# EAGLE design serial led controller (EAGLE 6.4)

## Sheet 1 of 2
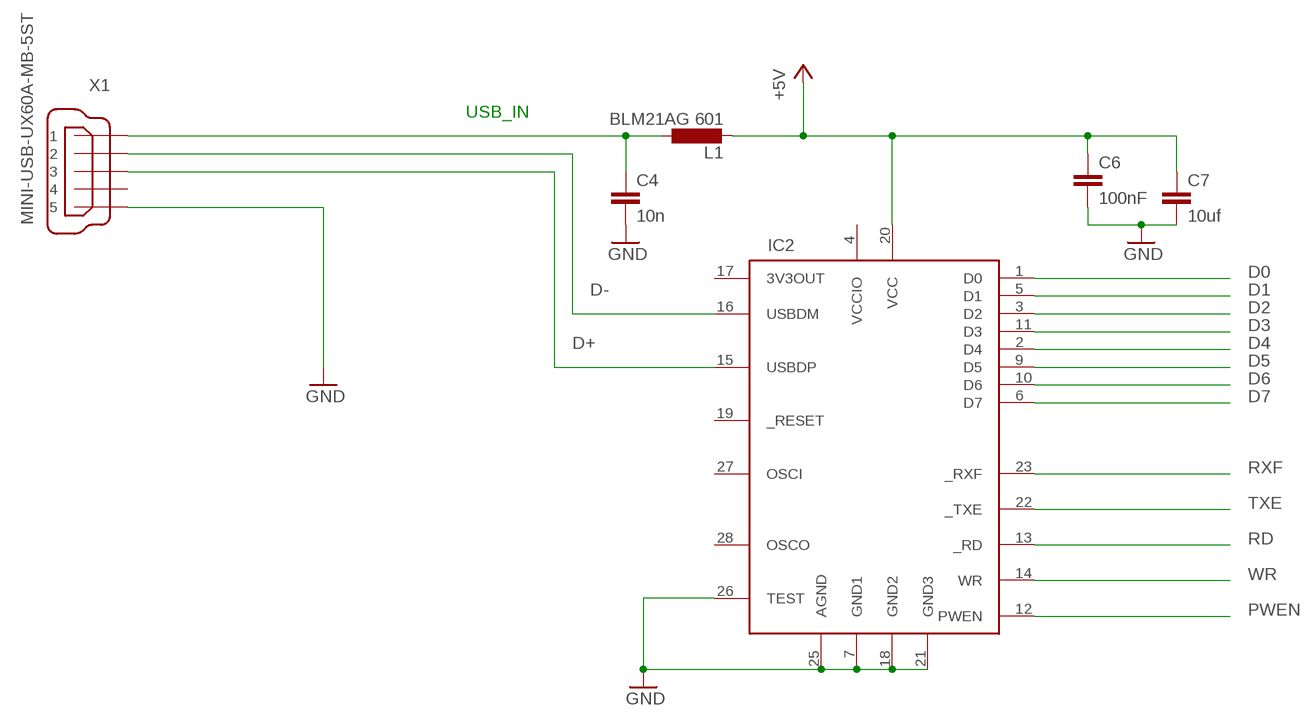
[diagram p0: schematic, sheet 1]

### Parts
C4  10n  C-EUC0603K  [C0603K]
C6  100nF  C-EUC0603K  [C0603K]
C7  10uf  C-EUC0603K  [C0603K]
IC2  FT245RL  [SSOP28DB]
L1  BLM21AG 601  L-EUL805  [L805]
X1  MINI-USB-UX60A-MB-5ST  [UX60A-MB-5ST]

### Nets
+5V: C6.1 C7.1 IC2.20(VCC) L1.2 ; also sheet 2
D0: IC2.1(D0) ; also sheet 2
D1: IC2.5(D1) ; also sheet 2
D2: IC2.3(D2) ; also sheet 2
D3: IC2.11(D3) ; also sheet 2
D4: IC2.2(D4) ; also sheet 2
D5: IC2.9(D5) ; also sheet 2
D6: IC2.10(D6) ; also sheet 2
D7: IC2.6(D7) ; also sheet 2
D+: IC2.15(USBDP) X1.3
D-: IC2.16(USBDM) X1.2
GND: C4.2 C6.2 C7.2 IC2.7(GND1) IC2.18(GND2) IC2.21(GND3) IC2.25(AGND) IC2.26(TEST) X1.5 ; also sheet 2
PWEN: IC2.12(PWEN)
RD: IC2.13(_RD) ; also sheet 2
RXF: IC2.23(_RXF) ; also sheet 2
TXE: IC2.22(_TXE) ; also sheet 2
USBSUPPLY: C4.1 L1.1 X1.1
WR: IC2.14(WR) ; also sheet 2
Unconnected: IC2.17(3V3OUT) IC2.19(_RESET) IC2.27(OSCI) IC2.28(OSCO) X1.4

### Notes on the sheet
- USB_IN

## Sheet 2 of 2
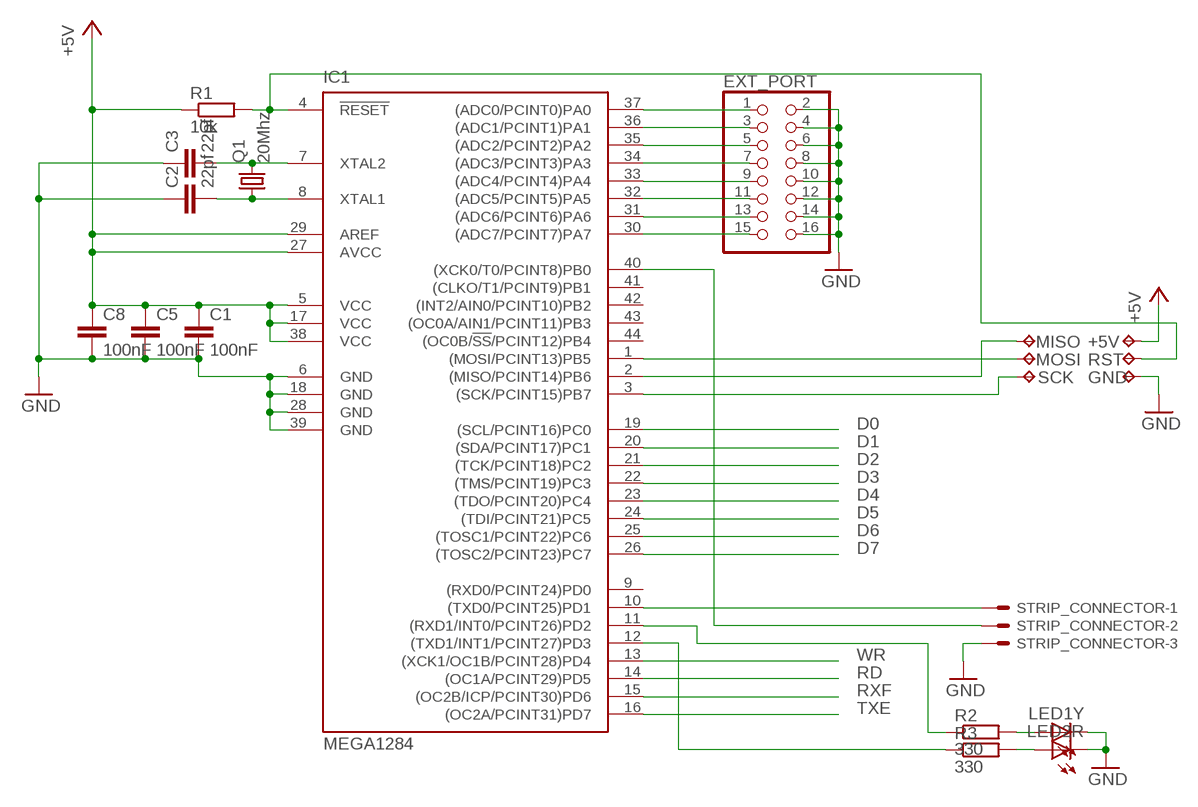
[diagram p1: schematic, sheet 2]

### Parts
+5V  TPTP19R  [TP19R]
C1  100nF  C-EUC0603K  [C0603K]
C2  22pf  C-EUC0603K  [C0603K]
C3  22pf  C-EUC0603K  [C0603K]
C5  100nF  C-EUC0603K  [C0603K]
C8  100nF  C-EUC0603K  [C0603K]
EXT_PORT  PINHD-2X8  [2X08]
GND  TPTP19R  [TP19R]
IC1  MEGA1284  MEGA164P/324P/644P-AU  [TQFP44]
LED1Y  LEDCHIP-LED0603  [CHIP-LED0603]
LED2R  LEDCHIP-LED0603  [CHIP-LED0603]
MISO  TPTP19R  [TP19R]
MOSI  TPTP19R  [TP19R]
Q1  20Mhz  CRYSTALSM49  [SM49]
R1  10k  R-EU_603  [R0603]
R2  330  R-EU_603  [R0603]
R3  330  R-EU_603  [R0603]
RST  TPTP19R  [TP19R]
SCK  TPTP19R  [TP19R]
STRIP_CONNECTOR  22-27-2031-03  [6410-03]

### Nets
+5V: +5V.TP C1.1 C5.1 C8.1 IC1.5(VCC) IC1.17(VCC) IC1.27(AVCC) IC1.29(AREF) IC1.38(VCC) R1.1 ; also sheet 1
CLOCK: IC1.40((XCK0/T0/PCINT8)PB0) STRIP_CONNECTOR.2
D0: IC1.19((SCL/PCINT16)PC0) ; also sheet 1
D1: IC1.20((SDA/PCINT17)PC1) ; also sheet 1
D2: IC1.21((TCK/PCINT18)PC2) ; also sheet 1
D3: IC1.22((TMS/PCINT19)PC3) ; also sheet 1
D4: IC1.23((TDO/PCINT20)PC4) ; also sheet 1
D5: IC1.24((TDI/PCINT21)PC5) ; also sheet 1
D6: IC1.25((TOSC1/PCINT22)PC6) ; also sheet 1
D7: IC1.26((TOSC2/PCINT23)PC7) ; also sheet 1
DATA: IC1.10((TXD0/PCINT25)PD1) STRIP_CONNECTOR.1
GND: C1.2 C2.1 C3.1 C5.2 C8.2 EXT_PORT.2 EXT_PORT.4 EXT_PORT.6 EXT_PORT.8 EXT_PORT.10 EXT_PORT.12 EXT_PORT.14 EXT_PORT.16 GND.TP IC1.6(GND) IC1.18(GND) IC1.28(GND) IC1.39(GND) LED1Y.C LED2R.C STRIP_CONNECTOR.3 ; also sheet 1
MISO: IC1.2((MISO/PCINT14)PB6) MISO.TP
MOSI: IC1.1((MOSI/PCINT13)PB5) MOSI.TP
N$1: EXT_PORT.15 IC1.30((ADC7/PCINT7)PA7)
N$2: EXT_PORT.13 IC1.31((ADC6/PCINT6)PA6)
N$3: IC1.11((RXD1/INT0/PCINT26)PD2) R2.1
N$4: EXT_PORT.11 IC1.32((ADC5/PCINT5)PA5)
N$5: EXT_PORT.9 IC1.33((ADC4/PCINT4)PA4)
N$6: IC1.12((TXD1/INT1/PCINT27)PD3) R3.1
N$7: EXT_PORT.7 IC1.34((ADC3/PCINT3)PA3)
N$8: C2.2 IC1.8(XTAL1) Q1.1
N$9: C3.2 IC1.7(XTAL2) Q1.2
N$10: EXT_PORT.5 IC1.35((ADC2/PCINT2)PA2)
N$11: EXT_PORT.3 IC1.36((ADC1/PCINT1)PA1)
N$13: EXT_PORT.1 IC1.37((ADC0/PCINT0)PA0)
N$21: LED1Y.A R2.2
N$22: LED2R.A R3.2
RD: IC1.14((OC1A/PCINT29)PD5) ; also sheet 1
RST: IC1.4(!RESET) R1.2 RST.TP
RXF: IC1.15((OC2B/ICP/PCINT30)PD6) ; also sheet 1
SCK: IC1.3((SCK/PCINT15)PB7) SCK.TP
TXE: IC1.16((OC2A/PCINT31)PD7) ; also sheet 1
WR: IC1.13((XCK1/OC1B/PCINT28)PD4) ; also sheet 1
Unconnected: IC1.9((RXD0/PCINT24)PD0) IC1.41((CLKO/T1/PCINT9)PB1) IC1.42((INT2/AIN0/PCINT10)PB2) IC1.43((OC0A/AIN1/PCINT11)PB3) IC1.44((OC0B/!SS!/PCINT12)PB4)

## Power pins joined to a net without a drawn wire
VCCIO: IC2.4(VCCIO)

## Library data of the parts
+5V GND MISO MOSI RST SCK = testpad:TP: Test pad
C1-C8 = rcl:C-EU: CAPACITOR, European symbol
EXT_PORT = pinhead:PINHD-2X8: PIN HEADER
IC1 = 0_avr:MEGA164P/324P/644P-AU
IC2 = ftdichip-3:FT245RL: USB FIFO Controller 4th Generation USB Controller (USB <-> Parallel) - FIFO
L1 = 0_Standard-Parts:L-EU: INDUCTOR, European symbol
LED1Y LED2R = led:LED: LED OSRAM: - CHIPLED LG R971, LG N971, LY N971, LG Q971, LY Q971, LO R971, LY R971 LH N974, LH R974 LS Q976, LO Q976, LY Q976 LO Q996 - Hyper CHIPLED LW Q18S LB Q993, LB Q99A, LB R99A - SideLED LS A670, LO A670, LY A670, LG A670, LP A670 LB A673, LV A673, LT A673, LW A673 LH A674 LY A675 LS A676, LA A676, LO A676, LY A676, LW A676 LS A679, LY A679, LG A679 - Hyper Micro SIDELED® LS Y876, LA Y876, LO Y876, LY Y876 LT Y87S - SmartLED LW L88C, LW L88S LB L89C, LB L89S, LG L890 LS L89K, LO L89K, LY L89K LS L896, LA L896, LO L896, LY L896 - TOPLED LS T670, LO T670, LY T670, LG T670, LP T670 LSG T670, LSP T670, LSY T670, LOP T670, LYG T670 LG T671, LOG T671, LSG T671 LB T673, LV T673, LT T673, LW T673 LH T674 LS T676, LA T676, LO T676, LY T676, LB T676, LH T676, LSB T676, LW T676 LB T67C, LV T67C, LT T67C, LS T67K, LO T67K, LY T67K, LW E67C LS E67B, LA E67B, LO E67B, LY E67B, LB E67C, LV E67C, LT E67C LW T67C LS T679, LY T679, LG T679 LS T770, LO T770, LY T770, LG T770, LP T770 LB T773, LV T773, LT T773, LW T773 LH T774 LS E675, LA E675, LY E675, LS T675 LS T776, LA T776, LO T776, LY T776, LB T776 LHGB T686 LT T68C, LB T68C - Hyper Mini TOPLED® LB M676 - Mini TOPLED Santana® LG M470 LS M47K, LO M47K, LY M47K Source: http://www.osram.convergy.de LUXEON: - LUMILED® LXK2-PW12-R00, LXK2-PW12-S00, LXK2-PW14-U00, LXK2-PW14-V00 LXK2-PM12-R00, LXK2-PM12-S00, LXK2-PM14-U00 LXK2-PE12-Q00, LXK2-PE12-R00, LXK2-PE12-S00, LXK2-PE14-T00, LXK2-PE14-U00 LXK2-PB12-K00, LXK2-PB12-L00, LXK2-PB12-M00, LXK2-PB14-N00, LXK2-PB14-P00, LXK2-PB14-Q00 LXK2-PR12-L00, LXK2-PR12-M00, LXK2-PR14-Q00, LXK2-PR14-R00 LXK2-PD12-Q00, LXK2-PD12-R00, LXK2-PD12-S00 LXK2-PH12-R00, LXK2-PH12-S00 LXK2-PL12-P00, LXK2-PL12-Q00, LXK2-PL12-R00 Source: www.luxeon.com KINGBRIGHT: KA-3528ASYC Source: www.kingbright.com
Q1 = crystal:CRYSTAL: CRYSTAL; OC_FARNELL: unknown; OC_NEWARK: unknown
R1-R3 = 0_Standard-Parts:R-EU_: RESISTOR, European symbol
STRIP_CONNECTOR = con-molex:22-?-03: CONNECTOR wire to board 2.54 mm (.1 inch) pitch header; OC_FARNELL: unknown; OC_NEWARK: unknown
X1 = con-hirose:MINI-USB-: MINI USB Connector Source: http://www.hirose.co.jp/cataloge_hp/e24000019.pdf; OC_FARNELL: unknown; OC_NEWARK: unknown

## Board
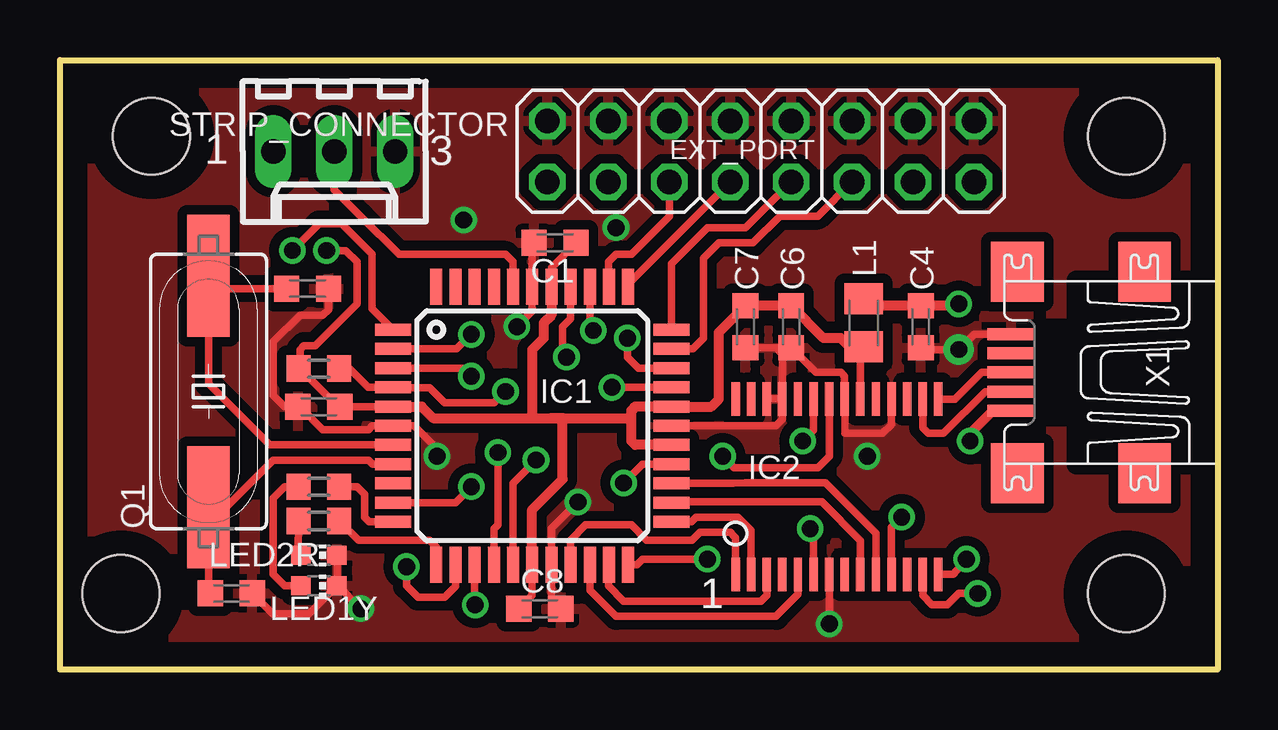
[diagram p2: board, top side]
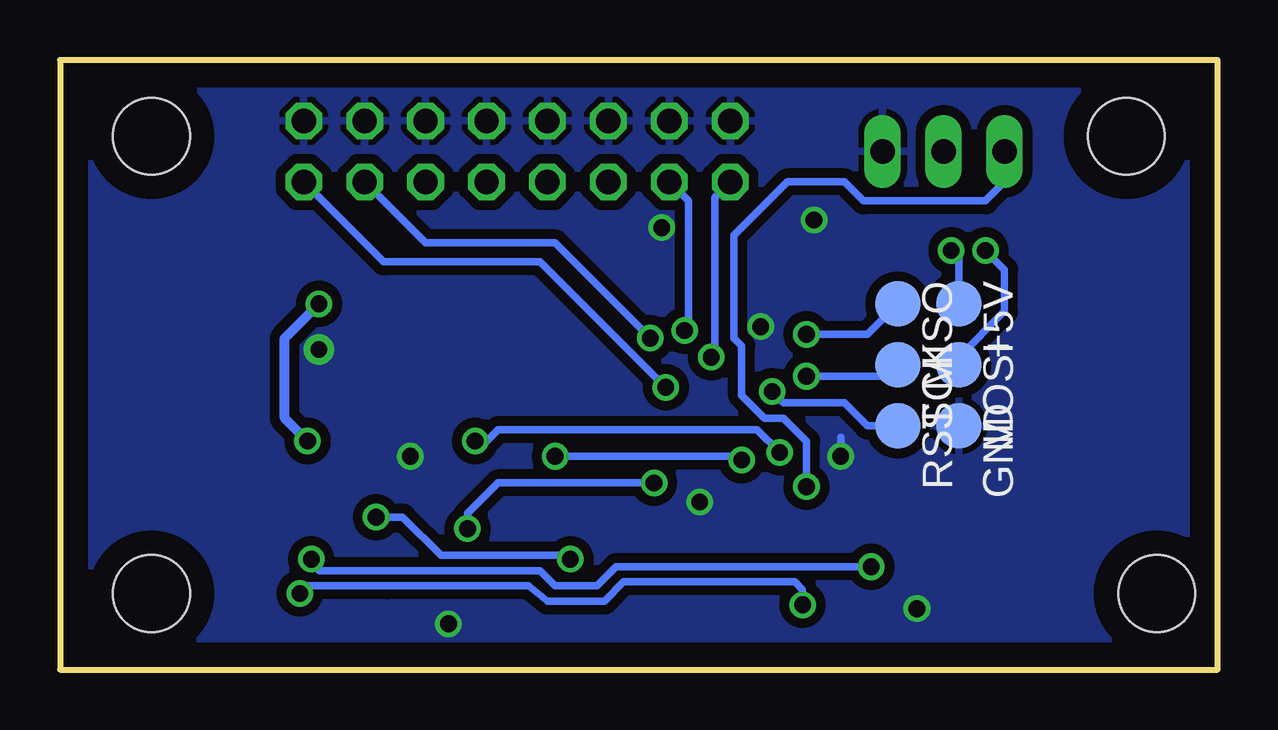
[diagram p3: board, bottom side, seen from below]

Size 48.26 x 25.4 mm. Coordinates in mm from the lower left corner, seen from the top.
Outline: 0,0 0,25.4 48.26,25.4 48.26,0 0,0
Copper layers (1*16): Top 0.035mm / dielectric 1.5mm / Bottom 0.035mm
Design rules "Bilex DRU *": minimum track width 10mil, minimum drill 24mil, track to track 10mil, track to pad 10mil, pad to pad 10mil, via to via 10mil, smd to smd 10mil, copper to edge 40mil, drill to drill 8mil, minimum pad ring 10mil, minimum via ring 8mil, stop-mask expansion 4mil, vias tented up to drill 0mil, thermal gap 10mil
Holes 3.2 mm at 44.45,22.23 44.45,3.17 2.54,3.17 3.81,22.23

### Footprints (pad centres in the part's own frame; a part is rotated, then mirrored left to right if it is on the bottom)
TP19R = smd 1.9 x 1.9: TP 0,0
C0603K = smd 1.05 x 1.08: 1 -0.875,0; 2 0.875,0
2X08 = drill 1.016 octagon: 1 -8.89,-1.27; 2 -8.89,1.27; 3 -6.35,-1.27; 4 -6.35,1.27; 5 -3.81,-1.27; 6 -3.81,1.27; 7 -1.27,-1.27; 8 -1.27,1.27; 9 1.27,-1.27; 10 1.27,1.27; 11 3.81,-1.27; 12 3.81,1.27; 13 6.35,-1.27; 14 6.35,1.27; 15 8.89,-1.27; 16 8.89,1.27
TQFP44 = smd 1.5 x 0.5: 1 -5.8,4; 2 -5.8,3.2; 3 -5.8,2.4; 4 -5.8,1.6; 5 -5.8,0.8; 6 -5.8,0; 7 -5.8,-0.8; 8 -5.8,-1.6; 9 -5.8,-2.4; 10 -5.8,-3.2; 11 -5.8,-4; 23 5.8,-4; 24 5.8,-3.2; 25 5.8,-2.4; 26 5.8,-1.6; 27 5.8,-0.8; 28 5.8,0; 29 5.8,0.8; 30 5.8,1.6; 31 5.8,2.4; 32 5.8,3.2; 33 5.8,4 | smd 0.5 x 1.5: 12 -4,-5.8; 13 -3.2,-5.8; 14 -2.4,-5.8; 15 -1.6,-5.8; 16 -0.8,-5.8; 17 0,-5.8; 18 0.8,-5.8; 19 1.6,-5.8; 20 2.4,-5.8; 21 3.2,-5.8; 22 4,-5.8; 34 4,5.8; 35 3.2,5.8; 36 2.4,5.8; 37 1.6,5.8; 38 0.8,5.8; 39 0,5.8; 40 -0.8,5.8; 41 -1.6,5.8; 42 -2.4,5.8; 43 -3.2,5.8; 44 -4,5.8
SSOP28DB = smd 0.348 x 1.397: 1 -4.225,-3.656; 2 -3.575,-3.656; 3 -2.925,-3.656; 4 -2.275,-3.656; 5 -1.625,-3.656; 6 -0.975,-3.656; 7 -0.325,-3.656; 8 0.325,-3.656; 9 0.975,-3.656; 10 1.625,-3.656; 11 2.275,-3.656; 12 2.925,-3.656; 13 3.575,-3.656; 14 4.225,-3.656; 15 4.225,3.656; 16 3.575,3.656; 17 2.925,3.656; 18 2.275,3.656; 19 1.625,3.656; 20 0.975,3.656; 21 0.325,3.656; 22 -0.325,3.656; 23 -0.975,3.656; 24 -1.625,3.656; 25 -2.275,3.656; 26 -2.925,3.656; 27 -3.575,3.656; 28 -4.225,3.656
L805 = smd 1.3 x 1.6: 1 -1,0; 2 1,0
CHIP-LED0603 = smd 0.8 x 0.8: A 0,-0.75; C 0,0.75
SM49 = smd 5.08 x 1.778: 1 -4.826,0; 2 4.826,0
R0603 = smd 1 x 1.1: 1 -0.85,0; 2 0.85,0
6410-03 = drill 1.016 long: 1 2.54,0; 2 0,0; 3 -2.54,0
UX60A-MB-5ST = smd 2 x 0.5: 1 2.25,1.6; 2 2.25,0.8; 3 2.25,0; 4 2.25,-0.8; 5 2.25,-1.6 | smd 2.2 x 2.5: M1 -3.3,-4.2; M2 -3.3,4.2; M3 2,4.2; M4 2,-4.2

### Placement (x,y rotation side)
+5V  10.79,15.24 270 bottom
C1  20.64,17.78 180 top
C2  7.14,3.17 180 top
C3  10.32,15.88 180 top
C4  35.88,14.29 270 top
C5  10.79,10.95 180 top
C6  30.48,14.29 270 top
C7  28.57,14.29 270 top
C8  20,2.54 0 top
EXT_PORT  29.21,21.59 0 top
GND  10.79,10.16 270 bottom
IC1  19.68,10.16 0 top
IC2  32.38,7.62 0 top
L1  33.5,14.45 270 top
LED1Y  10.79,3.49 270 top
LED2R  10.79,4.76 270 top
MISO  13.34,15.24 270 bottom
MOSI  10.79,12.7 270 bottom
Q1  6.19,11.59 90 top
R1  10.79,12.54 0 top
R2  10.79,7.62 180 top
R3  10.79,6.19 180 top
RST  13.34,10.16 270 bottom
SCK  13.34,12.7 270 bottom
STRIP_CONNECTOR  11.43,21.59 180 top
X1  41.91,12.38 180 top

### Tracks (layer width: path | path; a pad name or v marks a point on that pad's centre or on a via)
+5V  (via drill 0.7)
  Top 0.305: IC2.20 33.36,13.27 | 33.36,13.27 L1.2 | 33.36,13.27 33.09,13.27 | IC1.17 19.68,3.1 C8.1 | 21.59,17.78 C1.1 20.48,16.75 IC1.38 | IC1.5 C5.1 11.59,10.95 11.11,11.43 10,12.54 R1.1 10,12.6 10,13.18 10,13.34 10.16,13.49 10.64,13.49 12.38,15.24 12.38,16.99 11.91,17.46 v11.11,17.46
  Top 0.406: IC1.27 23.98,9.36 23.81,9.53 23.81,10.48 | 23.81,10.48 23.81,10.79 23.98,10.96 IC1.29 27.15,10.96 27.46,11.27 27.46,14.05 C7.1 C6.1 31.83,13.81 32.54,13.81 33.09,13.27 | 20.95,10.48 20.48,10.48 | 20.48,10.48 20.95,10.48 | 20.95,10.48 23.81,10.48 | IC1.17 19.68,6.67 20.95,7.94 20.95,10.48 | IC1.5 15.09,10.96 14.92,10.95 15.08,10.95 15.56,10.48 19.68,10.48 | IC1.38 20.48,14.92 20.48,14.77 20.16,14.45 20.16,13.81 19.68,13.34 19.68,11.59 19.68,10.48 | 19.68,10.48 20.48,10.48
  Bottom 0.305: 10.79,15.72 +5V.TP 10.79,17.14 v11.11,17.46
CLOCK
  Top 0.305: STRIP_CONNECTOR.2 11.43,20 12.54,18.89 14.13,17.3 15.24,17.3 18.57,17.3 18.89,16.99 IC1.40
D0
  Top 0.305: IC1.19 21.27,4.37 21.27,5.4 21.91,6.03 23.81,6.03 24.45,5.4 26.35,5.4 26.67,5.71 27.94,5.71 28.1,5.56 28.16,5.5 IC2.1
D1
  Top 0.305: IC2.5 30.76,3.14 29.84,2.22 23.18,2.22 22.23,3.17 22.09,3.31 IC1.20
D2
  Top 0.305: IC2.3 29.46,3.11 29.21,2.86 23.5,2.86 22.86,3.49 22.86,4.33 IC1.21
D3  (via drill 0.7)
  Top 0.305: IC1.22 24.05,4.36 24.29,4.6 v26.99,4.6 | IC2.11 34.66,5.93 v35.08,6.35
  Bottom 0.305: v26.99,4.6 27.15,4.76 32.38,4.76 33.97,6.35 v35.08,6.35
D4
  Top 0.305: IC1.23 26.32,6.16 26.51,6.35 28.26,6.35 28.81,5.8 IC2.2
D5
  Top 0.305: IC2.9 33.36,5.38 31.75,6.99 28.89,6.99 28.26,6.99 25.51,6.99 IC1.24
D6
  Top 0.305: IC1.25 28.08,7.76 28.57,7.78 31.91,7.78 33.81,5.87 34.01,5.68 IC2.10
D7  (via drill 0.7)
  Top 0.305: IC1.26 24.28,8.56 v23.5,7.78 | IC2.6 31.41,5.74 v31.27,5.87
  Bottom 0.305: v23.5,7.78 30,7.78 31.27,6.51 v31.27,5.87
D+
  Top 0.305: X1.3 38.42,12.38 37.31,11.27 IC2.15
D-
  Top 0.305: X1.2 38.57,11.58 36.83,9.84 36.2,9.84 35.96,10.08 IC2.16
DATA  (via drill 0.7)
  Top 0.305: IC1.10 16.48,6.96 v17.14,7.62
  Bottom 0.305: v17.14,7.62 17.14,9.53 18.1,10.48 18.89,10.48 19.84,11.43 19.84,13.49 20.16,13.81 20.16,18.1 19.21,19.05 17.94,20.32 15.56,20.32 14.76,19.53 9.68,19.53 8.89,20.32 8.89,20.95 STRIP_CONNECTOR.1
GND  (via drill 0.7, 0.7 pad 1.27)
  Top 0.305: IC2.26 IC2.25 | IC2.7 32.07,3.97 v32.07,1.91 | IC2.18 34.66,10.21 34.29,9.84 32.72,9.84 32.71,9.85 IC2.21 32.7,11.91 32.7,12.22 32.54,12.38 31.51,12.38 C6.2 | X1.5 38.11,13.98 v37.47,13.34 35.64,13.34 C4.2 | C6.2 29.84,13.41 | 29.84,13.41 C7.2 | IC2.25 30.11,13.15 29.84,13.41 | 30.56,13.34 C6.2 | C8.2 20.48,2.93 IC1.18 20.48,5.88 v21.59,6.99 | IC1.28 29.84,10.16 30.11,10.43 IC2.25 | v19.05,14.29 19.68,14.92 IC1.39 19.68,17.54 C1.2 | 10.28,2.22 10.38,2.32 | 10.38,2.32 LED1Y.C | LED2R.C LED1Y.C | C3.1 11.19,15.16 11.19,15 10.95,14.76 10,14.76 8.89,13.65 8.89,11.43 9.37,10.95 C5.2 10,10.95 10.95,10 12.86,10 13.02,10.16 IC1.6 14.76,10.16 15.08,9.84 15.72,9.21 v15.72,8.89 | LED1Y.C 11.59,3.49 v12.54,2.54 | C2.1 8.87,2.32 10.38,2.32
  Bottom 0.305: v19.05,14.29 19.21,14.13 | v21.59,6.99 21.59,6.67 | v15.72,8.89 15.72,9.68 | v12.54,2.54 12.7,2.38
  other vias: 33.66,8.89 16.83,18.73 23.18,18.41
  pour Bottom (isolate 0.406): 46.99,24.13 46.99,1.27 1.27,1.27 1.27,24.13
  pour Top (isolate 0.406): 1.27,24.13 46.99,24.13 46.99,1.27 1.27,1.27
MISO  (via drill 0.7)
  Top 0.305: IC1.2 16.54,13.36 v17.14,13.97
  Bottom 0.305: v17.14,13.97 14.61,13.97 MISO.TP
MOSI  (via drill 0.7)
  Top 0.305: v9.68,17.46 10.79,18.57 11.75,18.57 13.02,17.3 13.02,15.03 IC1.1
  Bottom 0.305: MOSI.TP 10.79,13.02 8.89,14.92 8.89,16.67 v9.68,17.46
N$1  (via drill 0.7)
  Top 0.305: IC1.30 v23.01,11.76
  Bottom 0.305: v23.01,11.76 23.01,11.73 28.26,16.99 34.77,16.99 EXT_PORT.15
N$2  (via drill 0.7)
  Top 0.305: IC1.31 24.11,12.56 23.65,13.02 v23.65,13.81
  Bottom 0.305: v23.65,13.81 27.62,17.78 33.02,17.78 EXT_PORT.13
N$3
  Top 0.305: IC1.11 12.89,6.16 12.7,6.35 12.7,7.3 12.38,7.62 R2.1
N$4
  Top 0.305: IC1.32 26.38,13.36 26.83,13.81 26.83,17.14 27.46,17.78 28.89,17.78 30,18.89 31.59,18.89 EXT_PORT.11
N$5
  Top 0.305: IC1.33 25.48,16.91 26.99,18.41 28.57,18.41 EXT_PORT.9
N$6
  Top 0.305: IC1.12 15.69,5.11 15.4,5.4 12.44,5.4 R3.1 11.8,6.03
N$7
  Top 0.305: EXT_PORT.7 26.04,18.41 24.13,16.51 23.68,16.07 IC1.34
N$8
  Top 0.305: IC1.8 13.03,8.56 12.86,8.73 8.89,8.73 8.72,8.56 6.67,6.51 6.67,4.7 Q1.1 6.19,3.25 C2.2
N$9
  Top 0.305: IC1.7 8.74,9.36 6.19,11.91 Q1.2 6.19,15.56 6.51,15.88 C3.2
N$10
  Top 0.305: EXT_PORT.5 25.4,18.89 23.81,17.3 23.18,17.3 22.86,16.99 22.86,15.98 IC1.35
N$11  (via drill 0.7)
  Top 0.305: IC1.36 22.09,14.27 v22.23,14.13
  Bottom 0.305: v22.23,14.13 22.07,14.29 22.07,19.21 22.07,19.53 EXT_PORT.3
N$13  (via drill 0.7)
  Top 0.305: IC1.37 21.29,14.62 20.95,14.29 20.95,13.18 v21.11,13.02
  Bottom 0.305: v21.11,13.02 20.95,13.18 20.95,19.68 EXT_PORT.1
N$21
  Top 0.305: R2.2 9.37,7.62 8.89,7.14 8.89,3.97 9.37,3.49 LED1Y.A
N$22
  Top 0.305: R3.2 9.92,4.89 LED2R.A
RD  (via drill 0.7)
  Top 0.305: IC1.14 17.29,2.72 v17.3,2.7 | IC2.13 35.96,3.09 36.35,2.7 36.99,2.7 37.47,3.17 v38.26,3.17
  Bottom 0.305: v17.3,2.7 17.3,3.33 17.62,3.65 24.77,3.65 25.56,2.86 27.94,2.86 28.73,3.49 34.61,3.49 37.94,3.49 v38.26,3.17
RST  (via drill 0.7)
  Top 0.305: 11.79,12.39 R1.2 12.06,12.54 12.22,12.38 12.85,11.76 IC1.4 13.9,11.75 15.4,11.75 16.03,11.11 18.1,11.11 v18.57,11.59
  Bottom 0.305: RST.TP 14.13,10.16 14.61,10.16 15.56,11.11 18.1,11.11 v18.57,11.59
RXF  (via drill 0.7)
  Top 0.305: IC2.23 31.41,9.98 v30.96,9.53 | IC1.15 18.1,4.37 18.1,5.87 18.26,6.03 v18.26,9.05
  Bottom 0.305: v30.96,9.53 30.48,9.53 30,10 29.84,10 19.21,10 v18.26,9.05
SCK  (via drill 0.7)
  Top 0.305: IC1.3 16.81,12.56 v17.14,12.22
  Bottom 0.305: v17.14,12.22 13.81,12.22 SCK.TP
TXE  (via drill 0.7)
  Top 0.305: IC1.16 18.89,7.77 v19.84,8.73 | IC2.22 32.06,10.64 32.07,10.64 32.07,8.89 31.59,8.41 28.1,8.41 v27.62,8.89
  Bottom 0.305: v19.84,8.73 20.16,8.73 20.32,8.89 v27.62,8.89
USBSUPPLY  (via drill 0.7)
  Top 0.406: X1.1 39.65,10.79 38.89,10.79 37.94,9.84 v37.94,9.53 | v37.47,15.24 37.39,15.16 C4.1 33.5,15.16 L1.1
  Bottom 0.406: v37.94,9.53 38.89,10.48 38.89,13.81 v37.47,15.24
WR  (via drill 0.7)
  Top 0.305: IC1.13 16.48,3.47 16.03,3.02 14.92,3.02 14.45,3.49 v14.45,4.29 | v37.78,4.6 37.24,3.97 IC2.14
  Bottom 0.305: v14.45,4.29 25.08,4.29 25.88,3.49 27.62,3.49 28.26,4.13 37.47,4.13 v37.78,4.6